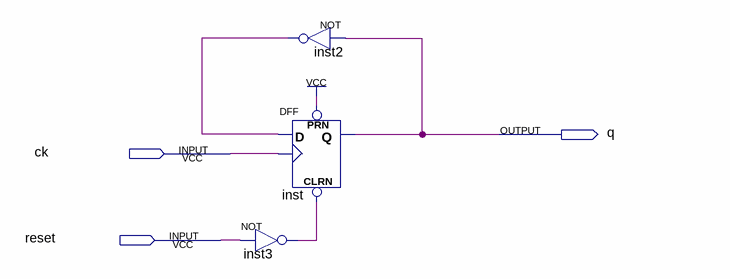
[diagram p0: schematic sheet]
// Quartus schematic pfs_freq_half.bdf as structural Verilog: 3 symbols, 3 pins
module pfs_freq_half (
  input  ck,
  input  reset,
  output q
);

  wire inst2_out, inst3_out;

  not inst3 (inst3_out, reset);
  not inst2 (inst2_out, q);
  DFF inst (.CLRN(inst3_out), .CLK(ck), .D(inst2_out), .PRN(1'b1), .Q(q));
endmodule
